# EAGLE design delay_generator (EAGLE 9.6.2)
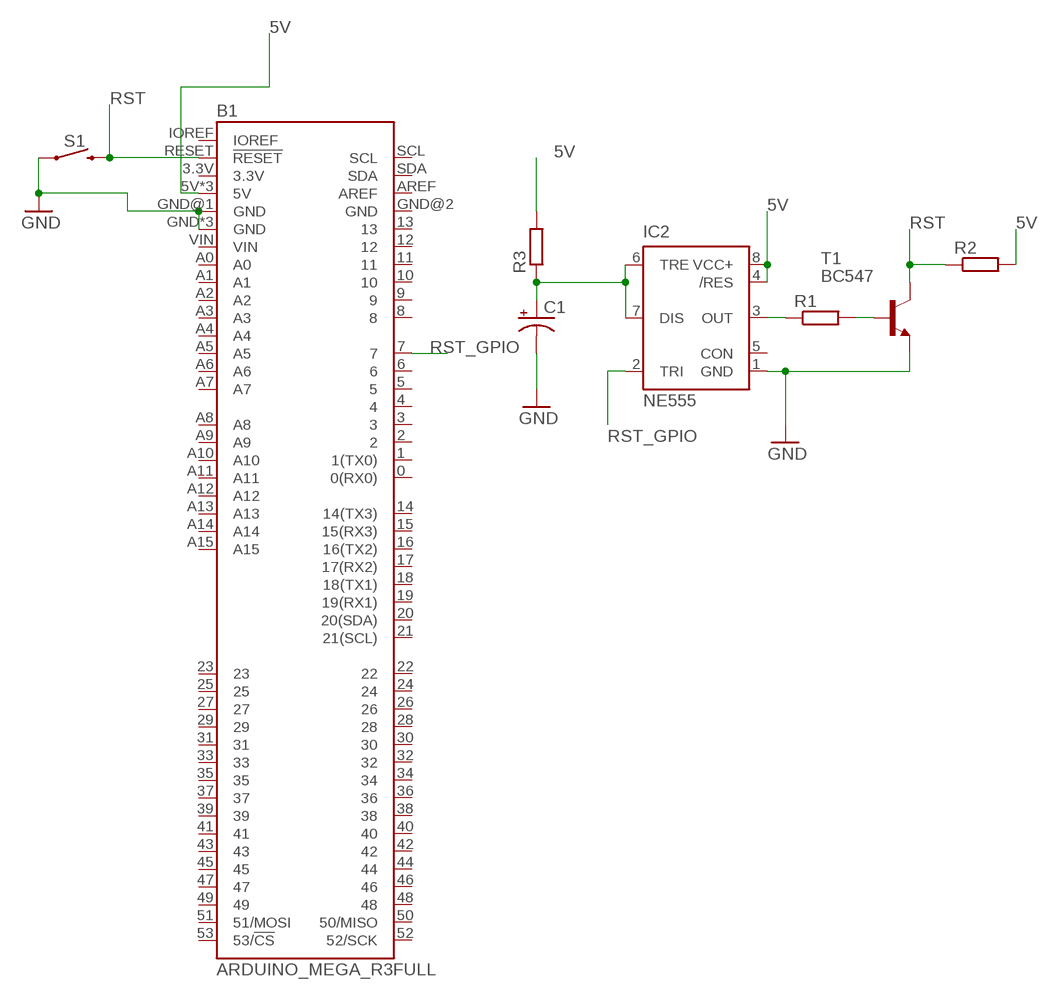
[diagram p0: schematic, sheet 1]

## Parts
B1  ARDUINO_MEGA_R3FULL  [ARDUINO_MEGA_NO_SILK]
C1  CPOL-USE2.5-6  [E2,5-6]
IC2  NE555  [DIL-08]
R1  R-EU_0204/7  [0204/7]
R2  R-EU_0204/7  [0204/7]
R3  R-EU_0204/7  [0204/7]
S1  MOMENTARY-SWITCH-SPST-PTH-6.0MM  [TACTILE_SWITCH_PTH_6.0MM]
T1  BC547  [TO92]

## Nets
5V: B1.5V B1.5V@1(5V) B1.5V@2(5V) IC2.4(/RES) IC2.8(VCC+) R2.2 R3.2
GND: B1.GND B1.GND@1(GND) B1.GND@3(GND) B1.GND@4(GND) C1.- IC2.1(GND) S1.1 T1.1(E)
N$1: C1.+ IC2.6(TRE) IC2.7(DIS) R3.1
N$2: IC2.3(OUT) R1.1
N$3: R1.2 T1.2(B)
RST: B1.RESET(!RESET) R2.1 S1.3 T1.3(C)
RST_GPIO: B1.7 IC2.2(TRI)
Unconnected: B1.0(0(RX0)) B1.1(1(TX0)) B1.2 B1.3 B1.3.3V B1.4 B1.5 B1.6 B1.8 B1.9 B1.10 B1.11 B1.12 B1.13 B1.14(14(TX3)) B1.15(15(RX3)) B1.16(16(TX2)) B1.17(17(RX2)) B1.18(18(TX1)) B1.19(19(RX1)) B1.20(20(SDA)) B1.21(21(SCL)) B1.22 B1.23 B1.24 B1.25 B1.26 B1.27 B1.28 B1.29 B1.30 B1.31 B1.32 B1.33 B1.34 B1.35 B1.36 B1.37 B1.38 B1.39 B1.40 B1.41 B1.42 B1.43 B1.44 B1.45 B1.46 B1.47 B1.48 B1.49 B1.50(50/MISO) B1.51(51/MOSI) B1.52(52/SCK) B1.53(53/!CS) B1.A0 B1.A1 B1.A2 B1.A3 B1.A4 B1.A5 B1.A6 B1.A7 B1.A8 B1.A9 B1.A10 B1.A11 B1.A12 B1.A13 B1.A14 B1.A15 B1.AREF B1.GND@2(GND) B1.IOREF B1.SCL B1.SDA B1.VIN IC2.5(CON)

## Library data of the parts
B1 = SparkFun-Boards:ARDUINO_MEGA_R3: Arduino Mega R3 ATmega2560 R3 compatible footprint. SparkFun Products: Arduino Mega 2560 R3 <https://www.sparkfun.com/products/11061>
C1 = rcl:CPOL-US: POLARIZED CAPACITOR, American symbol; SPICEPREFIX: C
IC2 = st-microelectronics:NE555: General purpose bipolar Timer; MF: Arrow Electronics; MPN: NE555N; OC_FARNELL: 1467742; OC_NEWARK: 89K1486
R1-R3 = rcl:R-EU_: RESISTOR, European symbol; SPICEPREFIX: R
S1 = SparkFun-Switches:MOMENTARY-SWITCH-SPST: Momentary Switch (Pushbutton) - SPST Normally-open (NO) SPST momentary switches (buttons, pushbuttons). Variants PTH-12MM - 12mm square, through-hole Momentary Pushbutton Switch - 12mm Square <https://www.sparkfun.com/products/9190> (COM-09190) PTH-6.0MM, PTH-6.0MM-KIT - 6.0mm square, through-hole Mini Pushbutton Switch <https://www.sparkfun.com/products/97> (COM-00097) KIT package intended for soldering kit's - only one side of pads' copper is exposed. PTH-RIGHT-ANGLE-KIT - Right-angle, through-hole Right Angle Tactile Button <https://www.sparkfun.com/products/10791> - Used on SparkFun BigTime Watch Kit <https://www.sparkfun.com/products/11734> SMD-12MM - 12mm square, surface-mount Tactile Button - SMD (12mm) <https://www.sparkfun.com/products/12993> (COM-12993) Used on SparkFun PicoBoard <https://www.sparkfun.com/products/11888> SMD-4.5MM - 4.5mm Square Trackball Switch Used on SparkFun Blackberry Trackballer Breakout <https://www.sparkfun.com/products/13169> SMD-4.6MMX2.8MM - 4.60mm x 2.80mm, surface mount Used on SparkFun SAMD21 Mini Breakout <https://www.sparkfun.com/products/13664> SMD-5.2MM, SMD-5.2-REDUNDANT - 5.2mm square, surface-mount Mini Pushbutton Switch - SMD <https://www.sparkfun.com/products/8720> (COM-08720) Used on Arduino Pro Mini <https://www.sparkfun.com/products/11114> REDUNDANT package connects both switch circuits together SMD-6.0X3.5MM - 6.0 x 3.5mm, surface mount Momentary Reset Switch SMD <https://www.sparkfun.com/products/8229> (COM-08229) SMD-6.2MM-TALL - 6.2mm square, surface mount Tactile Button - SMD (6mm) <https://www.sparkfun.com/products/12992> Used on SparkFun Digital Sandbox <https://www.sparkfun.com/products/12651> SMD-RIGHT-ANGLE - Right-angle, surface mount Used on SparkFun Block for Intel® Edison - Arduino <https://www.sparkfun.com/products/13036>; PROD_ID: SWCH-08441; SF_SKU: COM-00097
T1 = transistor:BC547: NPN TRANSISTOR

## Board
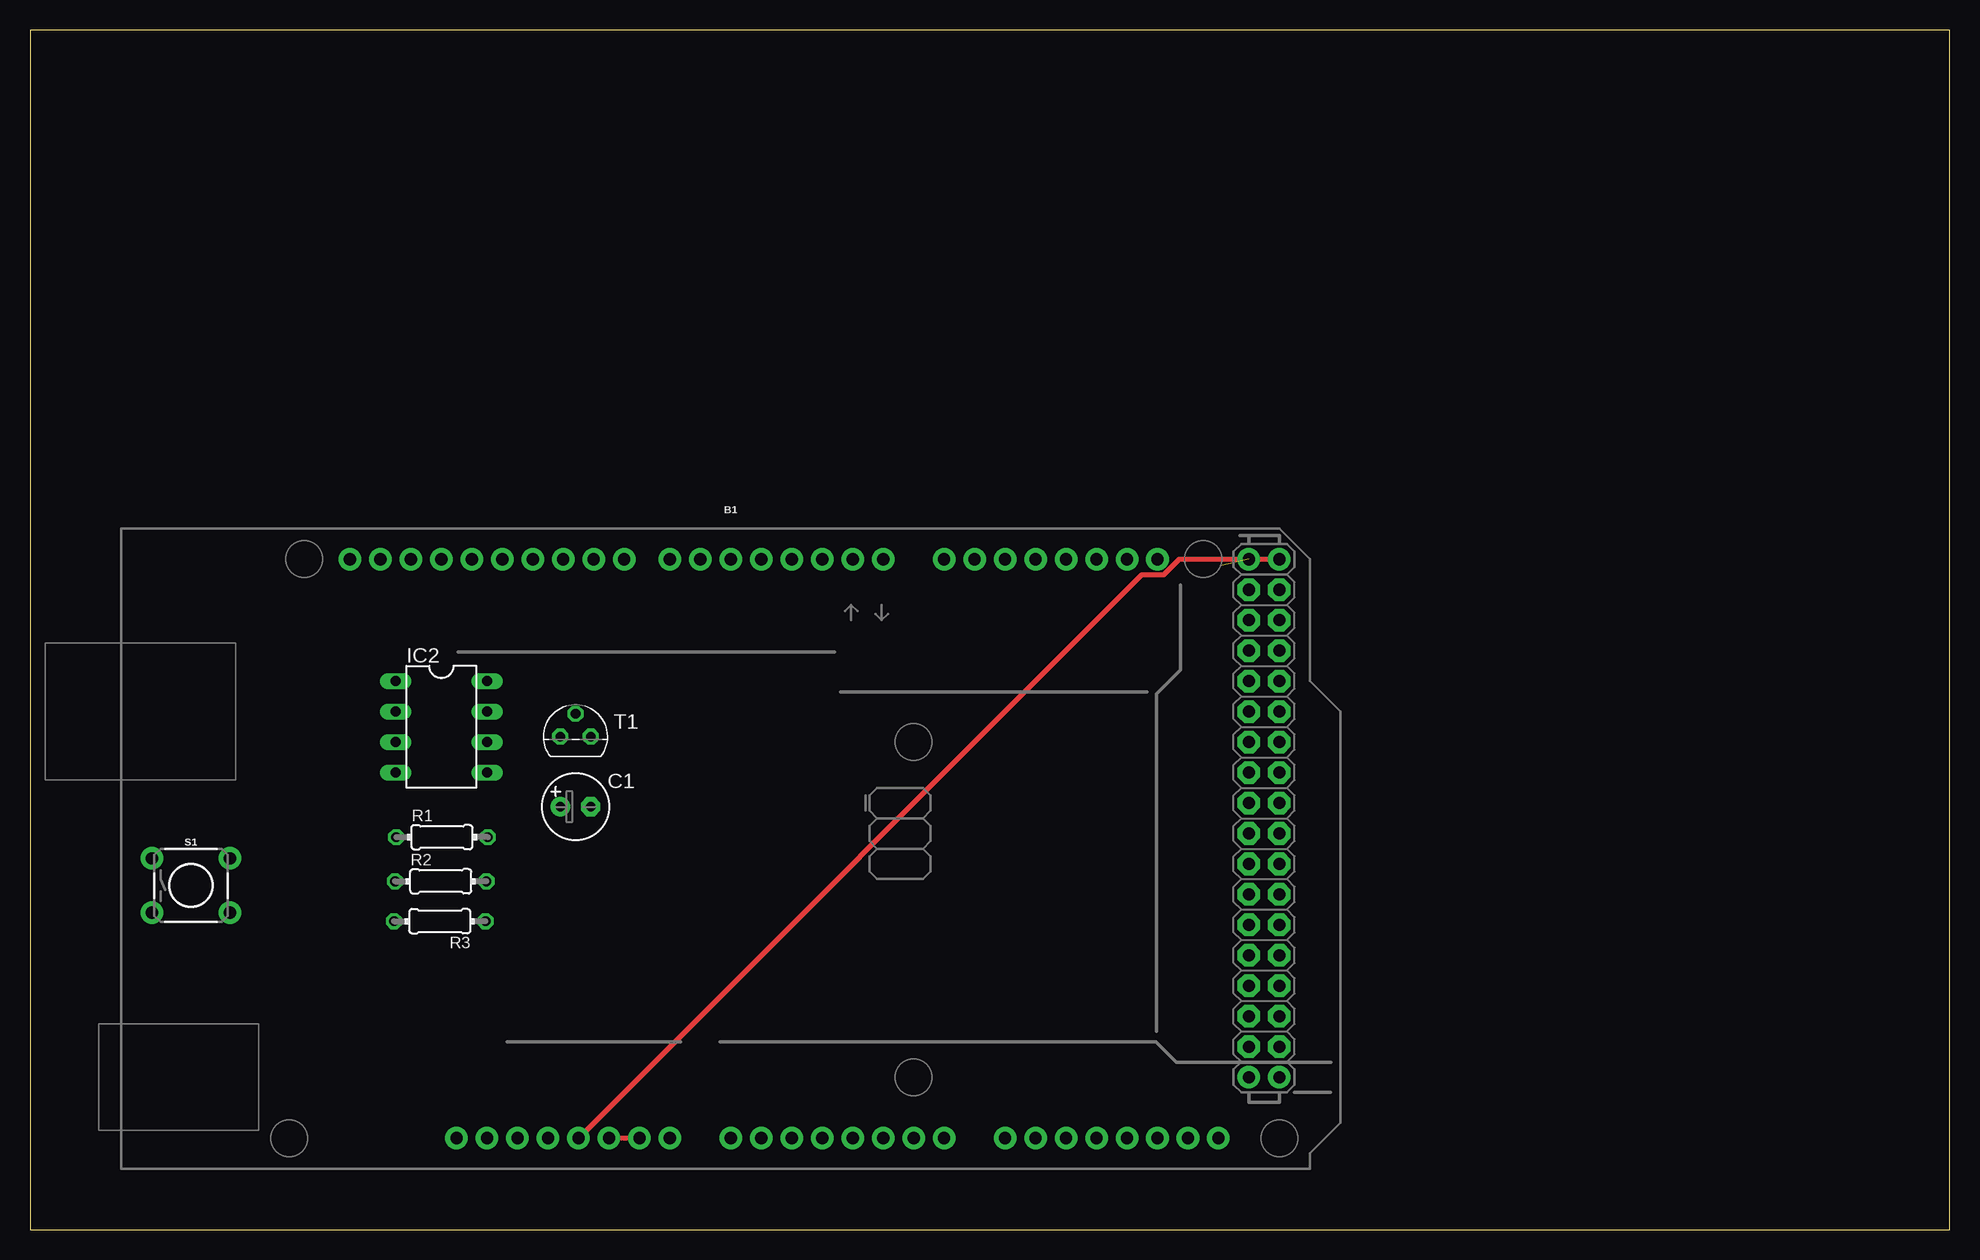
[diagram p1: board, top side]
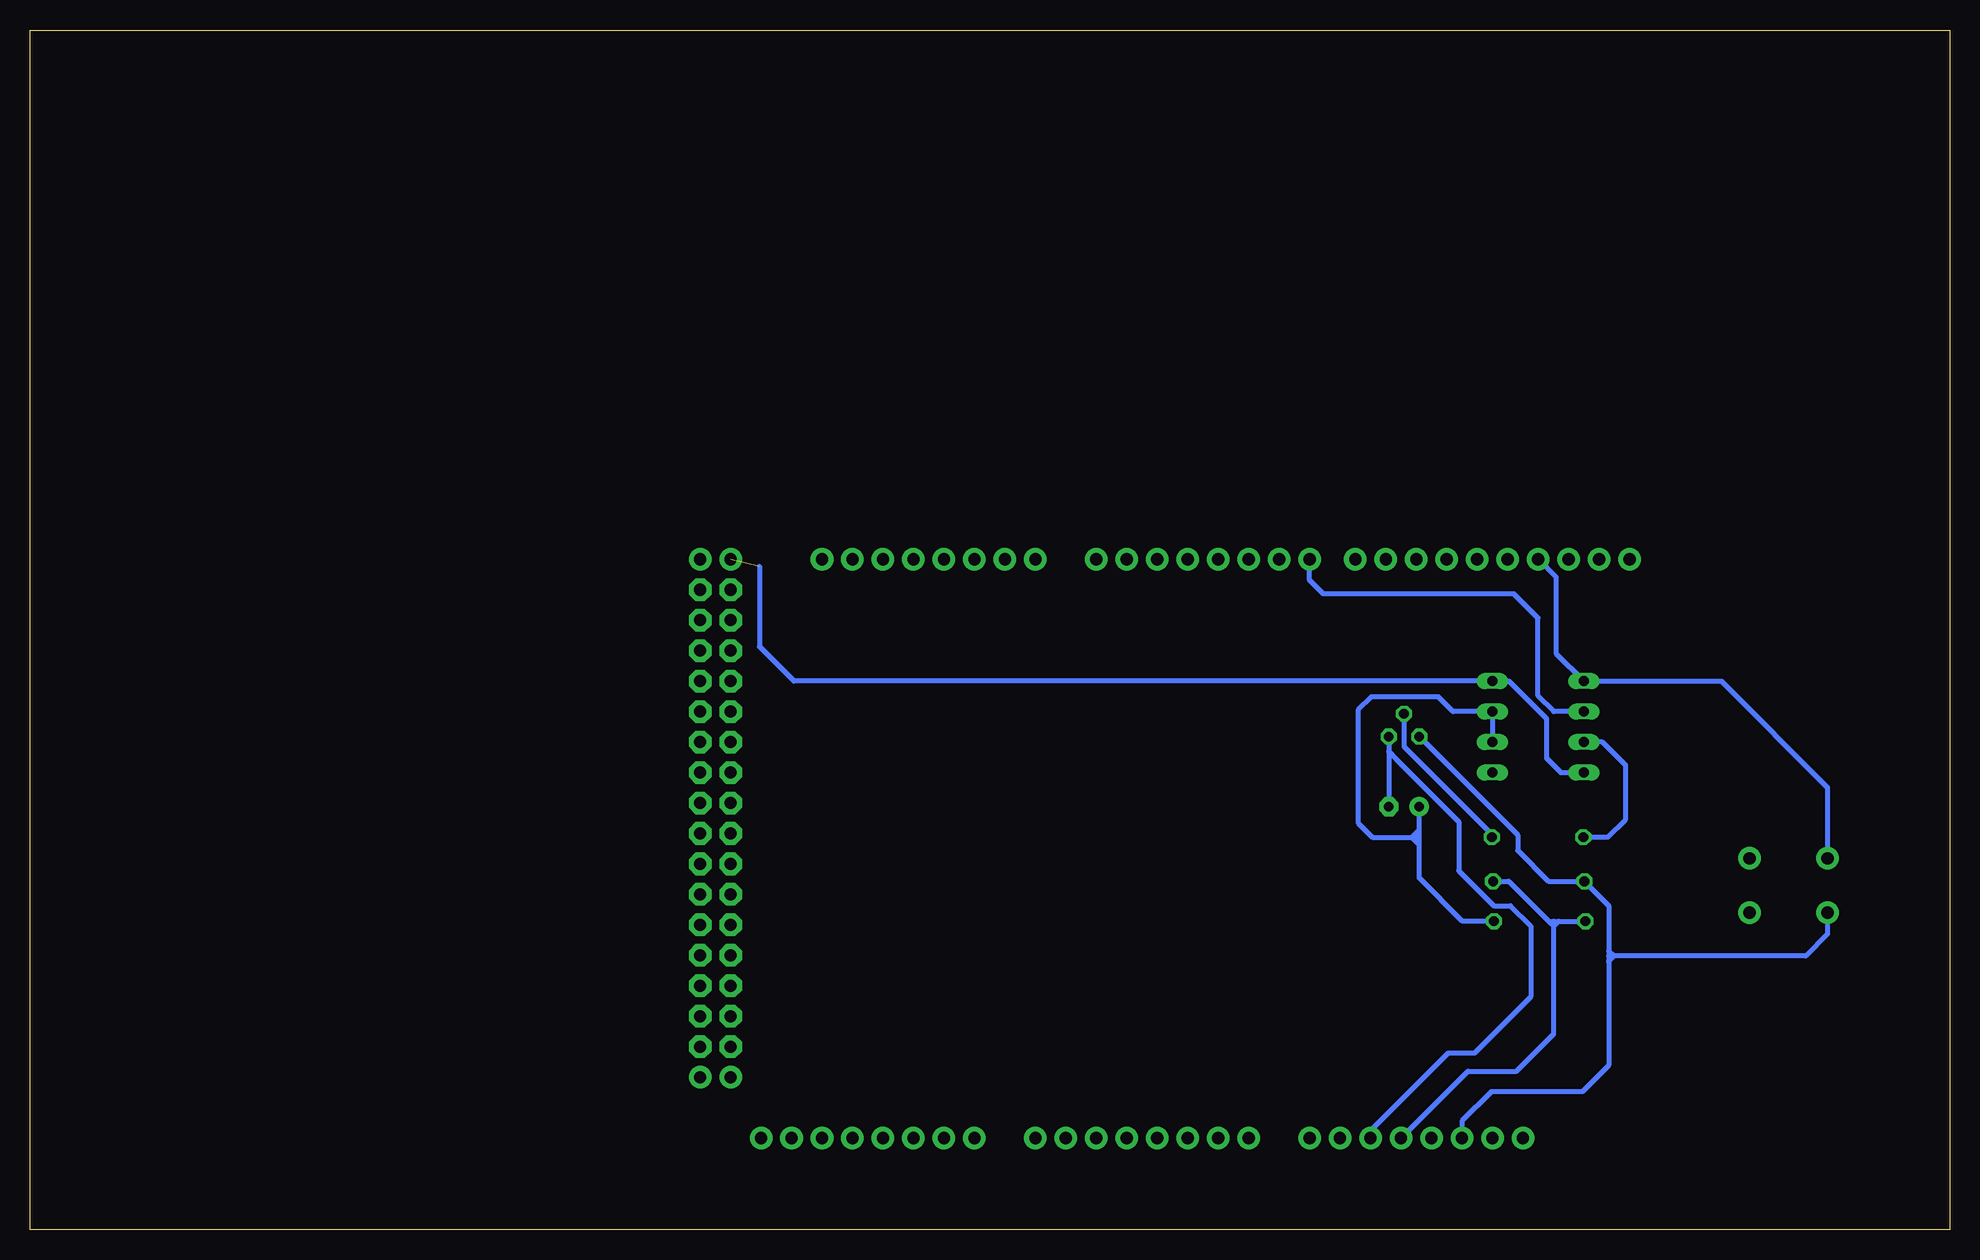
[diagram p2: board, bottom side, seen from below]

Size 160 x 100 mm. Coordinates in mm from the lower left corner, seen from the top.
Outline: 0,0 160,0 160,100 0,100 0,0
Copper layers (1*16): Top 0.035mm / dielectric 1.5mm / Bottom 0.035mm
Design rules "default": minimum track width 6mil, minimum drill 0.35mm, track to track 6mil, track to pad 6mil, pad to pad 6mil, via to via 6mil, smd to smd 6mil, copper to edge 40mil, drill to drill 6mil, minimum pad ring 10mil, minimum via ring 8mil, stop-mask expansion 4mil, vias tented up to drill 0mil, thermal gap 10mil

### Footprints (pad centres in the part's own frame; a part is rotated, then mirrored left to right if it is on the bottom)
ARDUINO_MEGA_NO_SILK = drill 1.016 pad 1.88: 0 13.97,24.13; 1 11.43,24.13; 2 8.89,24.13; 3 6.35,24.13; 3.3V -13.97,-24.13; 4 3.81,24.13; 5 1.27,24.13; 5V -11.43,-24.13; 5V@1 44.45,24.13; 5V@2 46.99,24.13; 6 -1.27,24.13; 7 -3.81,24.13; 8 -7.62,24.13; 9 -10.16,24.13; 10 -12.7,24.13; 11 -15.24,24.13; 12 -17.78,24.13; 13 -20.32,24.13; 14 19.05,24.13; 15 21.59,24.13; 16 24.13,24.13; 17 26.67,24.13; 18 29.21,24.13; 19 31.75,24.13; 20 34.29,24.13; 21 36.83,24.13; A0 1.27,-24.13; A1 3.81,-24.13; A2 6.35,-24.13; A3 8.89,-24.13; A4 11.43,-24.13; A5 13.97,-24.13; A6 16.51,-24.13; A7 19.05,-24.13; A8 24.13,-24.13; A9 26.67,-24.13; A10 29.21,-24.13; A11 31.75,-24.13; A12 34.29,-24.13; A13 36.83,-24.13; A14 39.37,-24.13; A15 41.91,-24.13; AREF -25.4,24.13; GND -8.89,-24.13; GND@1 -6.35,-24.13; GND@2 44.45,-19.05; GND@3 46.99,-19.05; GND@4 -22.86,24.13; IOREF -19.05,-24.13; NC -21.59,-24.13; RESET -16.51,-24.13; SCL -30.48,24.13; SDA -27.94,24.13; VIN -3.81,-24.13 | drill 1.016 pad 1.88 octagon: 22 44.45,21.59; 23 46.99,21.59; 24 44.45,19.05; 25 46.99,19.05; 26 44.45,16.51; 27 46.99,16.51; 28 44.45,13.97; 29 46.99,13.97; 30 44.45,11.43; 31 46.99,11.43; 32 44.45,8.89; 33 46.99,8.89; 34 44.45,6.35; 35 46.99,6.35; 36 44.45,3.81; 37 46.99,3.81; 38 44.45,1.27; 39 46.99,1.27; 40 44.45,-1.27; 41 46.99,-1.27; 42 44.45,-3.81; 43 46.99,-3.81; 44 44.45,-6.35; 45 46.99,-6.35; 46 44.45,-8.89; 47 46.99,-8.89; 48 44.45,-11.43; 49 46.99,-11.43; 50 44.45,-13.97; 51 46.99,-13.97; 52 44.45,-16.51; 53 46.99,-16.51
E2,5-6 = drill 0.813 pad 1.6: + -1.27,0 | drill 0.813 pad 1.6 octagon: - 1.27,0
DIL-08 = drill 0.813 long: 1 -3.81,-3.81; 2 -1.27,-3.81; 3 1.27,-3.81; 4 3.81,-3.81; 5 3.81,3.81; 6 1.27,3.81; 7 -1.27,3.81; 8 -3.81,3.81
0204/7 = drill 0.813 octagon: 1 -3.81,0; 2 3.81,0
TACTILE_SWITCH_PTH_6.0MM = drill 1.016 pad 1.88: 1 -3.251,2.261; 2 3.251,2.261; 3 -3.251,-2.261; 4 3.251,-2.261
TO92 = drill 0.813 octagon: 1 1.27,0; 2 0,1.905; 3 -1.27,0

### Placement (x,y rotation side)
B1  57.15,31.75 0 top
C1  45.47,35.25 0 top
IC2  34.29,41.91 270 top
R1  34.34,32.71 0 top
R2  34.24,29.03 0 top
R3  34.16,25.7 180 top
S1  13.42,28.68 0 top
T1  45.47,41.09 0 top

### Tracks (layer width: path | path; a pad name or v marks a point on that pad's centre or on a via)
5V  (1 unrouted)
  Top 0.406: B1.5V 92.69,54.59 94.52,54.59 95.81,55.88 B1.5V@1 B1.5V@2
  Bottom 0.406: IC2.4 32.4,38.1 33.6,39.3 33.6,42.6 36.72,45.72 IC2.8 96.32,45.72 99.2,48.6 99.2,55.3 | R2.2 36.73,29.03 33.4,25.7 | 33.4,25.7 33,25.7 | 33,25.7 32.6,25.7 | 32.6,25.7 R3.2 | B1.5V 40.14,13.2 36.1,13.2 33,16.3 33,25.3 | 33,25.3 33,25.7 | 33.4,25.7 33,25.3 | 33,25.3 32.6,25.7
GND
  Top 0.406: B1.GND@1 B1.GND
  Bottom 0.406: C1.- T1.1 46.74,39.84 46.15,39.25 40.9,34 40.9,29.9 38,27 36.6,27 34.9,25.3 34.9,19.4 39.6,14.7 41.8,14.7 48.26,8.24 B1.GND | S1.1 10.17,36.87 19.02,45.72 IC2.1 32.8,48.04 32.8,54.39 B1.GND@4
N$1
  Bottom 0.406: IC2.6 IC2.7 41.38,43.18 42.6,44.4 48.2,44.4 49.3,43.3 49.3,33.9 48.1,32.7 44.8,32.7 | R3.1 40.6,25.7 44.2,29.3 44.2,32.2 | 44.2,32.2 44.2,32.7 | 44.2,32.7 44.2,33.3 | 44.2,33.3 C1.+ | 44.2,32.7 44.8,32.7 | 44.8,32.7 44.2,33.3 | 44.8,32.7 44.3,32.2 44.2,32.2
N$2
  Bottom 0.406: R1.1 28.49,32.71 27,34.2 27,38.7 28.94,40.64 IC2.3
N$3
  Bottom 0.406: T1.2 45.47,40.27 38.15,32.95 R1.2
RST
  Bottom 0.406: T1.3 36,32.89 36,31.6 33.43,29.03 R2.1 28.4,27 28.4,23.2 | B1.RESET 40.64,9.06 38.2,11.5 30.6,11.5 28.4,13.7 28.4,22.3 28.4,22.4 | 28.4,23.2 28.4,22.8 | 28.4,22.8 28.4,22.4 | S1.3 10.17,24.63 12,22.8 28,22.8 | 28,22.8 28.4,22.8 | 28,22.8 28.4,23.2 | 28,22.8 28.4,22.4
RST_GPIO
  Bottom 0.406: IC2.2 32.98,43.18 34.3,44.5 34.3,51 36.3,53 52.2,53 53.34,54.14 B1.7